# Altium schematic sheet Connectors.SchDoc
size A; SheetNumber: 5; SheetTotal: 12
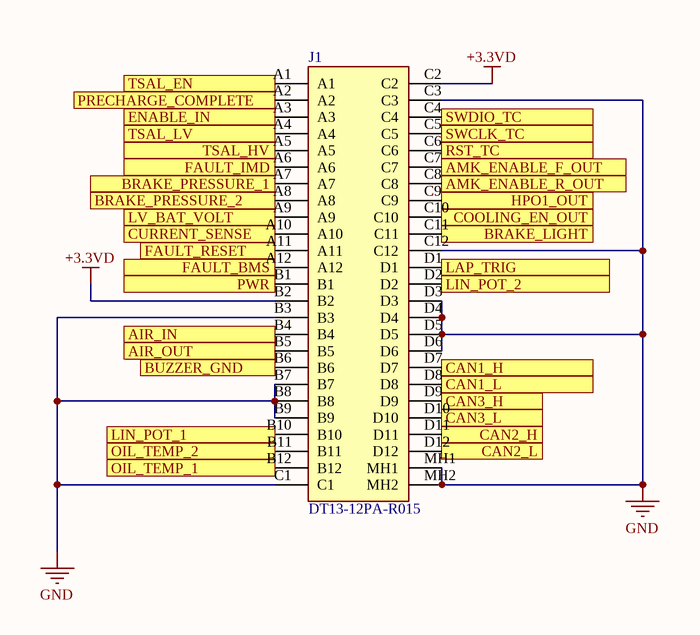
[diagram p0: Connectors.SchDoc]

## Parts
J1  DT13-12PA-R015  [DT1312PAR015]

## Ports
AIR_IN, AIR_OUT, AMK_ENABLE_F_OUT, AMK_ENABLE_R_OUT, BRAKE_LIGHT, BRAKE_PRESSURE_1, BRAKE_PRESSURE_2, BUZZER_GND, CAN1_H, CAN1_L, CAN2_H, CAN2_L, CAN3_H, CAN3_L, COOLING_EN_OUT, CURRENT_SENSE, ENABLE_IN, FAULT_BMS, FAULT_IMD, FAULT_RESET, HPO1_OUT, LAP_TRIG, LIN_POT_1, LIN_POT_2, LV_BAT_VOLT, OIL_TEMP_1, OIL_TEMP_2, PRECHARGE_COMPLETE, PWR, RST_TC, SWCLK_TC, SWDIO_TC, TSAL_EN, TSAL_HV, TSAL_LV

## Nets
+3.3VD: J1.B2 J1.C2
GND: J1.B3 J1.B7 J1.B8 J1.B9 J1.C1 J1.C3 J1.C12 J1.D3 J1.D4 J1.D5 J1.D6 J1.MH1 J1.MH2
AIR_IN: J1.B4 ; port AIR_IN
AIR_OUT: J1.B5 ; port AIR_OUT
AMK_ENABLE_F_OUT: J1.C7 ; port AMK_ENABLE_F_OUT
AMK_ENABLE_R_OUT: J1.C8 ; port AMK_ENABLE_R_OUT
BRAKE_LIGHT: J1.C11 ; port BRAKE_LIGHT
BRAKE_PRESSURE_1: J1.A7 ; port BRAKE_PRESSURE_1
BRAKE_PRESSURE_2: J1.A8 ; port BRAKE_PRESSURE_2
BUZZER_GND: J1.B6 ; port BUZZER_GND
CAN1_H: J1.D7 ; port CAN1_H
CAN1_L: J1.D8 ; port CAN1_L
CAN2_H: J1.D11 ; port CAN2_H
CAN2_L: J1.D12 ; port CAN2_L
CAN3_H: J1.D9 ; port CAN3_H
CAN3_L: J1.D10 ; port CAN3_L
COOLING_EN_OUT: J1.C10 ; port COOLING_EN_OUT
CURRENT_SENSE: J1.A10 ; port CURRENT_SENSE
ENABLE_IN: J1.A3 ; port ENABLE_IN
FAULT_BMS: J1.A12 ; port FAULT_BMS
FAULT_IMD: J1.A6 ; port FAULT_IMD
FAULT_RESET: J1.A11 ; port FAULT_RESET
HPO1_OUT: J1.C9 ; port HPO1_OUT
LAP_TRIG: J1.D1 ; port LAP_TRIG
LIN_POT_1: J1.B10 ; port LIN_POT_1
LIN_POT_2: J1.D2 ; port LIN_POT_2
LV_BAT_VOLT: J1.A9 ; port LV_BAT_VOLT
OIL_TEMP_1: J1.B12 ; port OIL_TEMP_1
OIL_TEMP_2: J1.B11 ; port OIL_TEMP_2
PRECHARGE_COMPLETE: J1.A2 ; port PRECHARGE_COMPLETE
PWR: J1.B1 ; port PWR
RST_TC: J1.C6 ; port RST_TC
SWCLK_TC: J1.C5 ; port SWCLK_TC
SWDIO_TC: J1.C4 ; port SWDIO_TC
TSAL_EN: J1.A1 ; port TSAL_EN
TSAL_HV: J1.A5 ; port TSAL_HV
TSAL_LV: J1.A4 ; port TSAL_LV

## Library data of the parts
J1 = CMP-057-000070-1: Automotive Connectors EEC HEADER; Manufacturer_Name: TE Connectivity; Geometry.Height: 53.25mm; Mouser Price/Stock: https://www.mouser.co.uk/ProductDetail/TE-Connectivity-DEUTSCH/DT13-12PA-R015?qs=cgQJD%2FpJz0xZmI47WX6OlA%3D%3D; Source: DT13-12PA-R015.SchLib; Datasheet Link: https://www.te.com/commerce/DocumentDelivery/DDEController?Action=showdoc&DocId=Customer+Drawing%7FDT13-XPX-R015%7F-%7Fpdf%7FEnglish%7FENG_CD_DT13-XPX-R015_-.pdf%7FDT13-12PA-R015; Manufacturer_Part_Number: DT13-12PA-R015; Mouser Part Number: 571-DT13-12PA-R015; Design Item ID: DT13-12PA-R015